# EAGLE design Wio Node v1.0 (EAGLE 6.4)

## Sheet 1 of 2
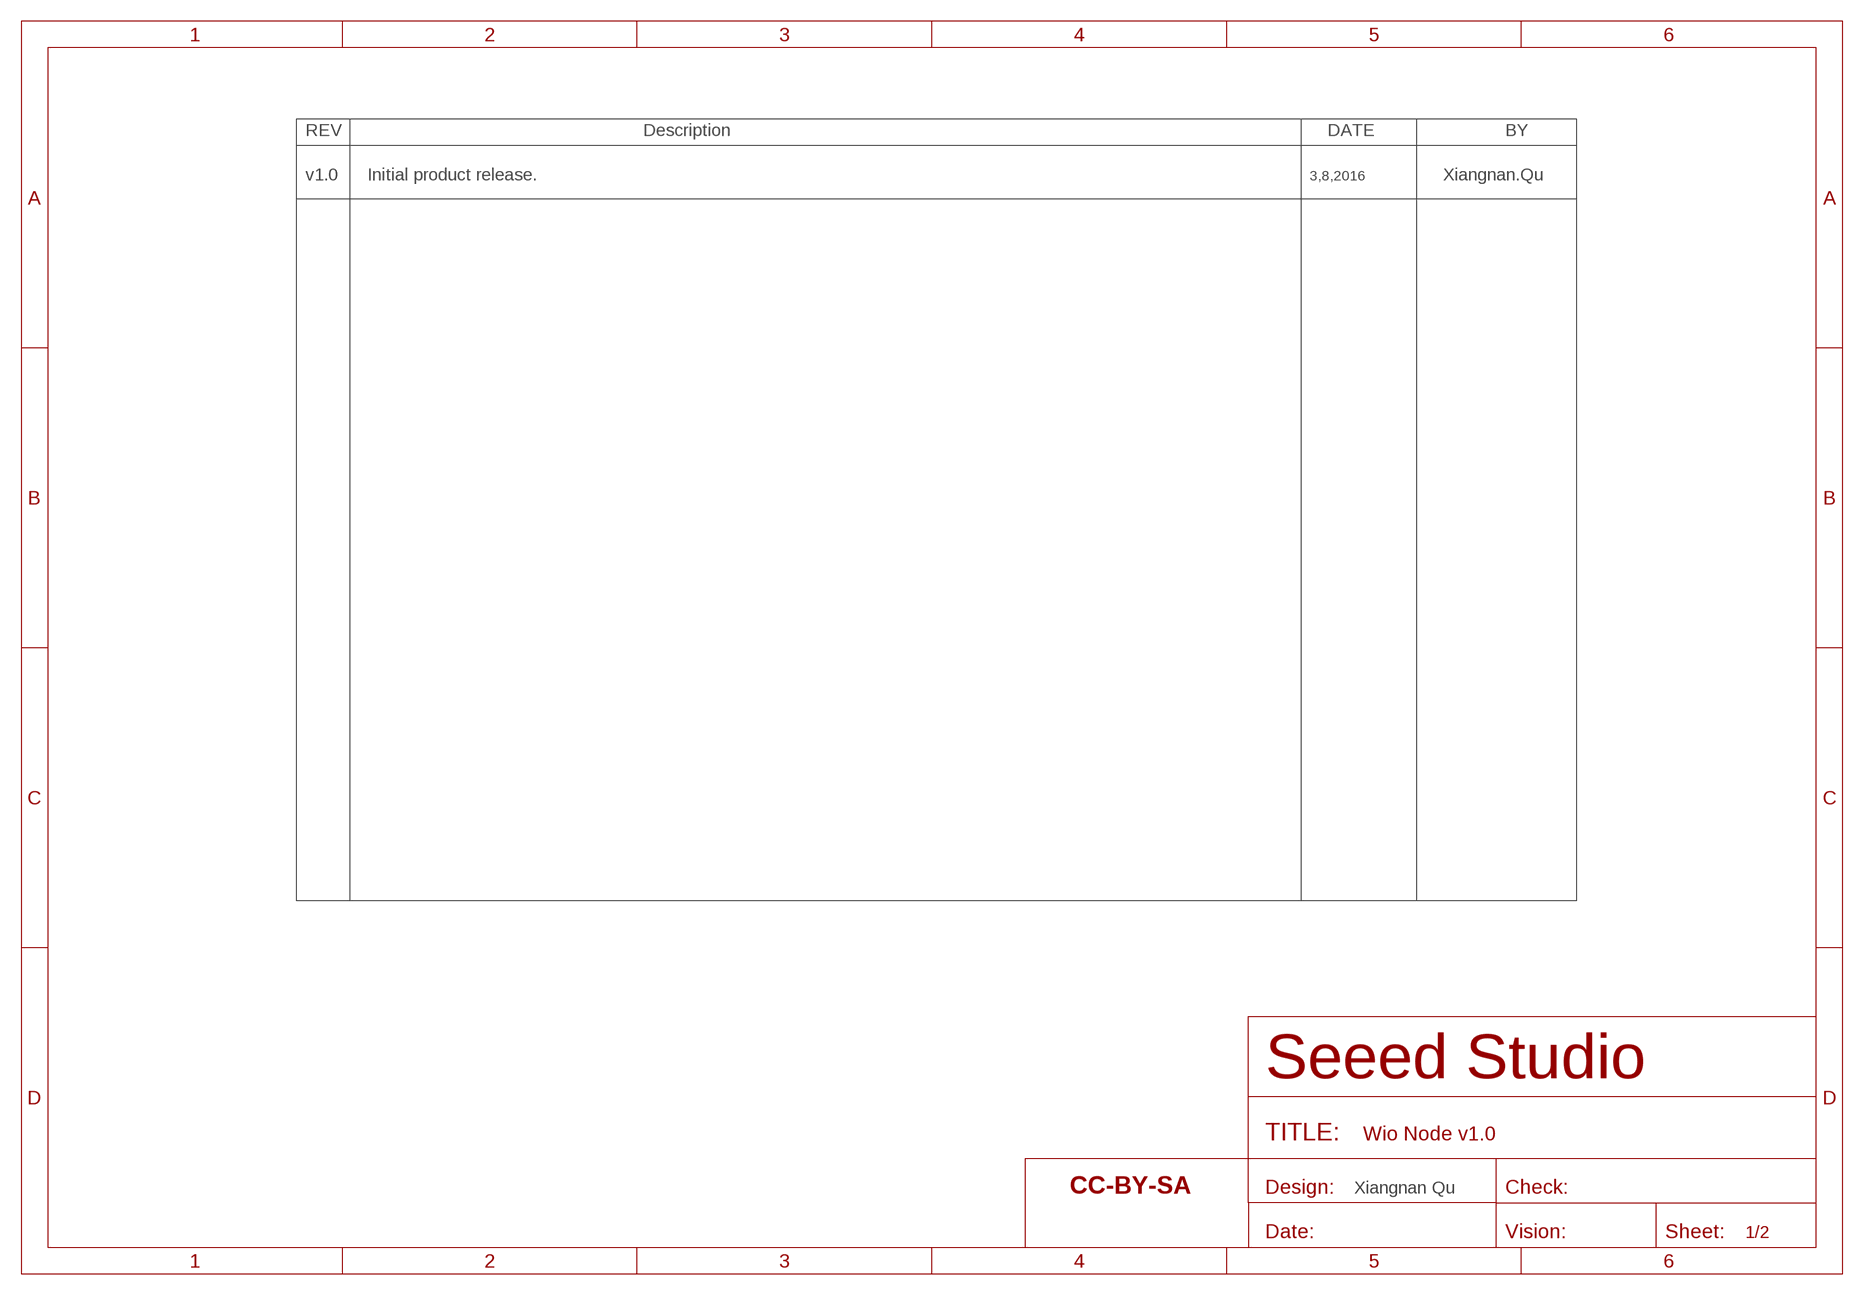
[diagram p0: schematic, sheet 1]

### Parts
FR4  SEEEDSTUDIO-OPEN-SCH-FRAME  [SEEEDSTUDIO-PCB-FRAME]

### Notes on the sheet
- v1.0 | Initial product release. | 3,8,2016 | Xiangnan.Qu
- Xiangnan Qu

## Sheet 2 of 2
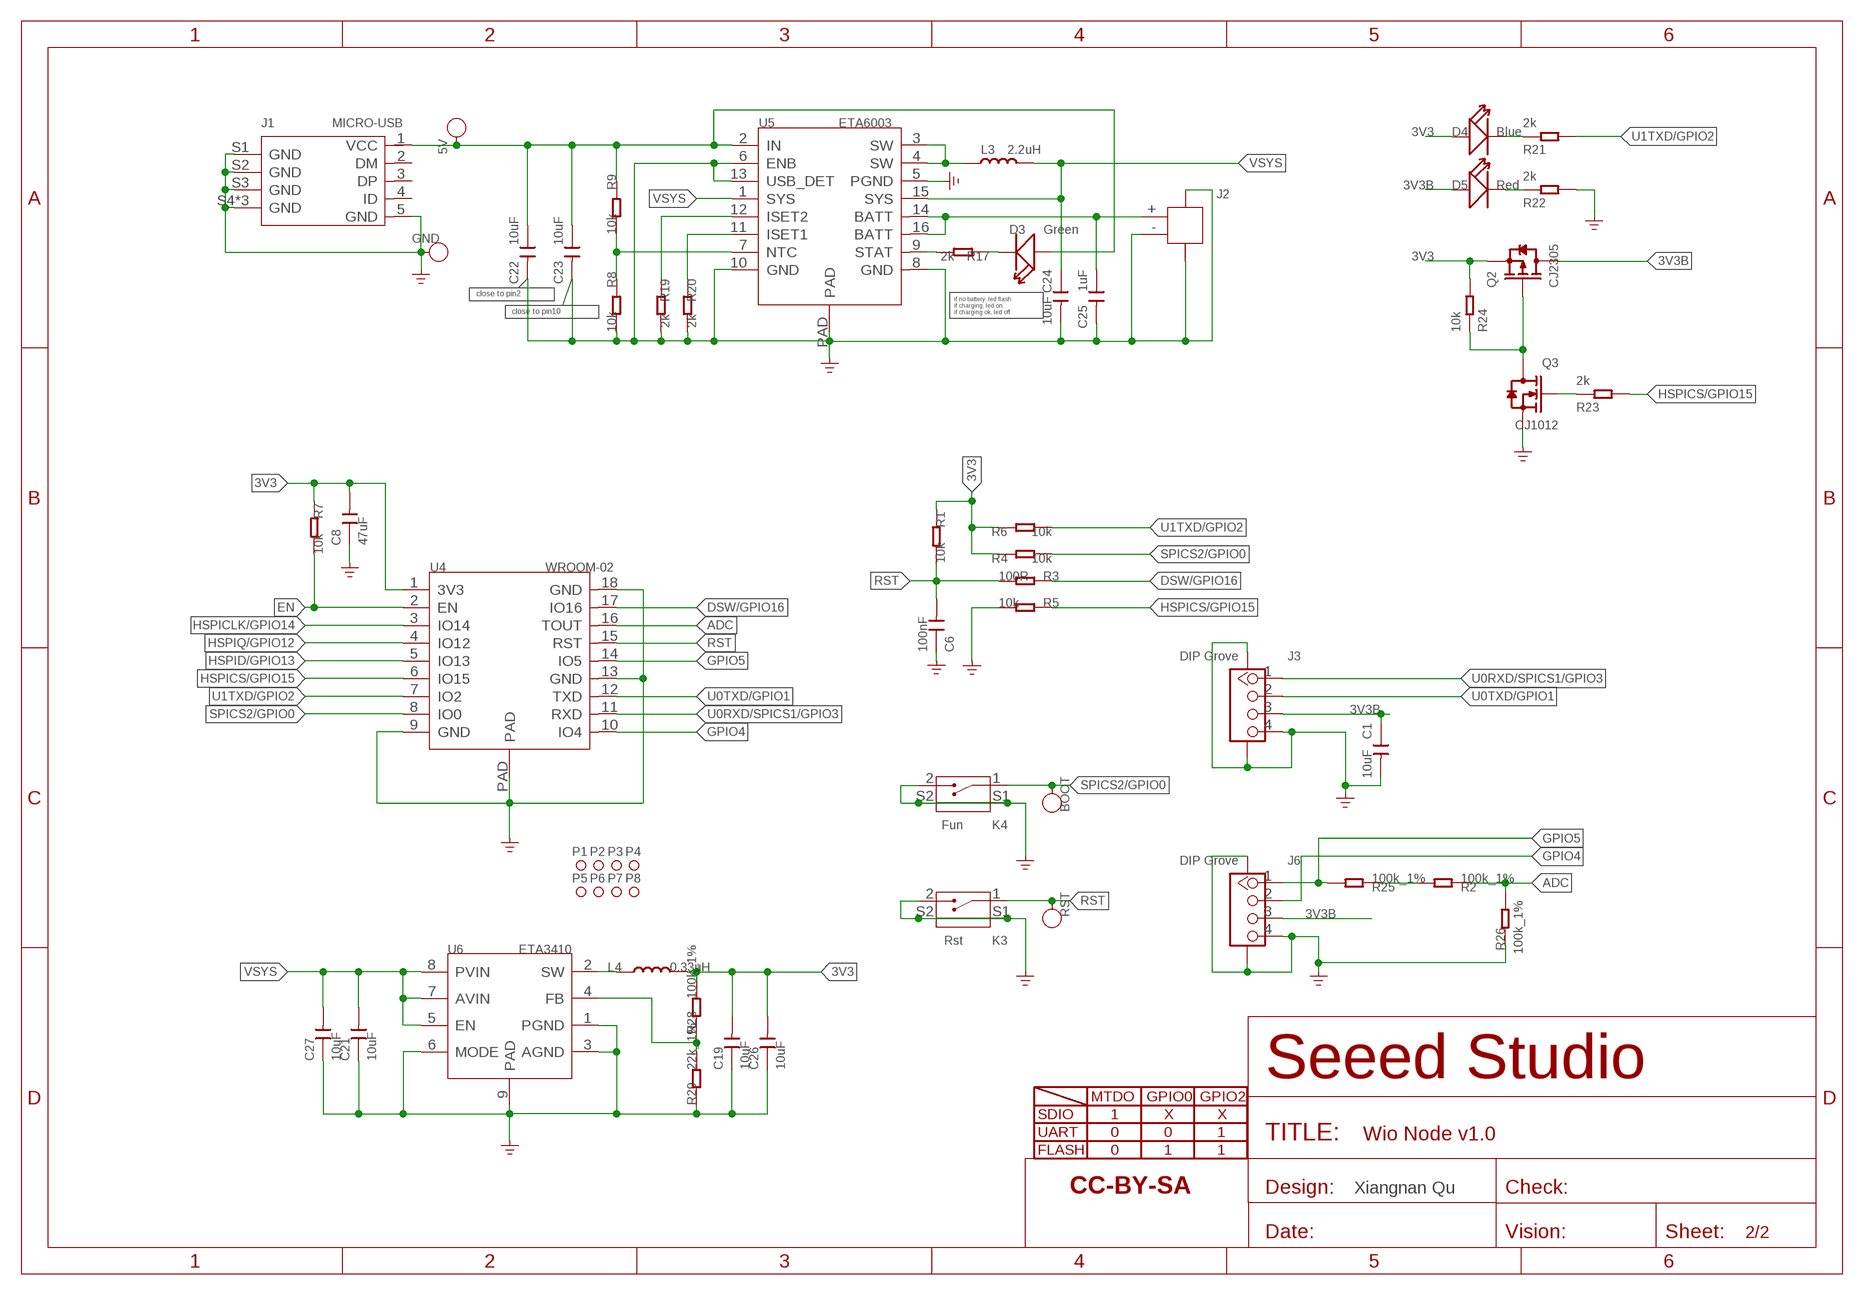
[diagram p1: schematic, sheet 2]

### Parts
5V  TEST-POINT'4545'  [TP-D45MIL]
BOOT  TEST-POINT'4545'  [TP-D45MIL]
C1  10uF  CAP-0402  [C0402]
C6  100nF  CAP-0201  [C0201]
C8  47uF  CAP-0805  [C0805]
C19  10uF  CAP-0402  [C0402]
C21  10uF  CAP-0402  [C0402]
C22  10uF  CAP-0805  [C0805]
C23  10uF  CAP-0402  [C0402]
C24  10uF  CAP-0402  [C0402]
C25  1uF  CAP-0402  [C0402]
C26  10uF  CAP-0402  [C0402]
C27  10uF  CAP-0402  [C0402]
D3  Green  LED-0402  [LED-0402]
D4  Blue  LED-0402  [LED-0402]
D5  Red  LED-0402  [LED-0402]
FR1  SEEEDSTUDIO-OPEN-SCH-FRAME  [SEEEDSTUDIO-PCB-FRAME]
GND  TEST-POINT'4545'  [TP-D45MIL]
J1  MICRO-USB  MICRO-USB5+4P'5+4P'  [MICRO-USB5+4P-SMD-0.65-B]
J2  JST-2P-SMD'2.0'  [HW2-SMD-2.0-90D]
J3  DIP Grove  GROVE-CONNECTOR-SMD'90D'  [HW4-SMD-2.0-90D]
J6  DIP Grove  GROVE-CONNECTOR-SMD'90D'  [HW4-SMD-2.0-90D]
K3  Rst  BUTTON-2+2P'HQ-TP-1100A'  [SW4-SMD-4.5X3.8X1.8MM-90D]
K4  Fun  BUTTON-2+2P'HQ-TP-1100A'  [SW4-SMD-4.5X3.8X1.8MM-90D]
L3  2.2uH  INDUCTOR/FERRITE-BEAD'0805'  [L0805]
L4  0.33uH  L-MPM201610SR33_T  [L201610]
P1  MARK-1.0'ANNULAR'  [ROUND-MARK-1.0]
P2  MARK-1.0'ANNULAR'  [ROUND-MARK-1.0]
P3  MARK-1.0'ANNULAR'  [ROUND-MARK-1.0]
P4  MARK-1.0'ANNULAR'  [ROUND-MARK-1.0]
P5  MARK-1.0'ANNULAR'  [ROUND-MARK-1.0]
P6  MARK-1.0'ANNULAR'  [ROUND-MARK-1.0]
P7  MARK-1.0'ANNULAR'  [ROUND-MARK-1.0]
P8  MARK-1.0'ANNULAR'  [ROUND-MARK-1.0]
Q2  CJ2305  MOSFET-P'SI2323CDS/SI2305DS<BR>'  [SOT-23]
Q3  CJ1012  MOSFET-N+  [SOT-523]
R1  10k  RES-0201  [R0201]
R2  100k_1%  RES-0201  [R0201]
R3  100R  RES-0201  [R0201]
R4  10k  RES-0201  [R0201]
R5  10k  RES-0201  [R0201]
R6  10k  RES-0201  [R0201]
R7  10k  RES-0201  [R0201]
R8  10k  RES-0201  [R0201]
R9  10k  RES-0201  [R0201]
R17  2k  RES-0201  [R0201]
R19  2k  RES-0201  [R0201]
R20  2k  RES-0201  [R0201]
R21  2k  RES-0201  [R0201]
R22  2k  RES-0201  [R0201]
R23  2k  RES-0201  [R0201]
R24  10k  RES-0201  [R0201]
R25  100k_1%  RES-0201  [R0201]
R26  100k_1%  RES-0201  [R0201]
R28  100k_1%  RES-0201  [R0201]
R29  22k_1%  RES-0402  [R0402]
RST  TEST-POINT'4545'  [TP-D45MIL]
U4  WROOM-02  MOUDLE-WIFI-ESP-WROOM-02  [ESP18-SMD-1.5-18X20MM]
U5  ETA6003  PMIC-ETA6003  [QFN16G-0.5-3X3MM]
U6  ETA3410  CONVERTER-ETA3410  [DFN8G-0.5-2X2MM]

### Nets
3V3: C8.2 C19.2 C26.2 D4.+ L4.2 Q2.2(S) R1.1 R4.1 R6.1 R7.1 R24.2 R28.2 U4.1(3V3)
3V3B: C1.1 D5.+ J3.3 J6.3 Q2.3(D)
ADC: R2.1 R26.2 U4.16(TOUT)
DSW/GPIO16: R3.1 U4.17(IO16)
EN: R7.2 U4.2(EN)
GND: C1.2 C6.1 C8.1 C19.1 C21.1 C22.2 C23.2 C24.2 C25.2 C26.1 C27.1 GND.T J1.5(GND) J1.S1(GND) J1.S2(GND) J1.S3(GND) J1.S4(GND) J1.S5(GND) J1.S6(GND) J2.3 J2.4 J2.- J3.4 J3.SS1 J3.SS2 J6.4 J6.SS1 J6.SS2 K3.2 K3.S1 K3.S2 K4.2 K4.S1 K4.S2 Q3.2(S) R5.2 R8.2 R19.2 R20.2 R22.2 R26.1 R29.1 U4.9(GND) U4.13(GND) U4.18(GND) U4.PAD U5.5(PGND) U5.6(ENB) U5.8(GND) U5.10(GND) U5.13(USB_DET) U5.PAD U6.1(PGND) U6.3(AGND) U6.6(MODE) U6.9(PAD) ; supply symbol labelled GND_POWER
GPIO4: J6.2 U4.10(IO4)
GPIO5: J6.1 R25.2 U4.14(IO5)
HSPICLK/GPIO14: U4.3(IO14)
HSPICS/GPIO15: R5.1 R23.2 U4.6(IO15)
HSPID/GPIO13: U4.5(IO13)
HSPIQ/GPIO12: U4.4(IO12)
N$1: R2.2 R25.1
N$3: R8.1 R9.2 U5.7(NTC)
N$7: Q2.1(G) Q3.3(D) R24.1
N$11: Q3.1(G) R23.1
N$14: D4.- R21.1
N$22: D5.- R22.1
N$26: L3.1 U5.3(SW) U5.4(SW)
N$28: C25.1 J2.+ U5.14(BATT) U5.16(BATT)
N$29: L4.1 U6.2(SW)
N$30: D3.- R17.1
N$31: R17.2 U5.9(STAT)
N$32: R28.1 R29.2 U6.4(FB)
N$34: R20.1 U5.11(ISET1)
N$36: R19.1 U5.12(ISET2)
RST: C6.2 K3.1 R1.2 R3.2 RST.T U4.15(RST)
SPICS2/GPIO0: BOOT.T K4.1 R4.2 U4.8(IO0)
U0RXD/SPICS1/GPIO3: J3.1 U4.11(RXD)
U0TXD/GPIO1: J3.2 U4.12(TXD)
U1TXD/GPIO2: R6.2 R21.2 U4.7(IO2)
VSYS: C21.2 C24.1 C27.2 L3.2 U5.1(SYS) U5.15(SYS) U6.5(EN) U6.7(AVIN) U6.8(PVIN)
VUSB: 5V.T C22.1 C23.1 D3.+ J1.1(VCC) R9.1 U5.2(IN)
Unconnected: J1.2(DM) J1.3(DP) J1.4(ID)

### Notes on the sheet
- close to pin2
- close to pin10
- if no battery, led flash.
  if charging, led on.
  if charging ok, led off.
- MTDO | GPIO0 | GPIO2
- SDIO | 1 | X | X
- UART | 0 | 0 | 1
- FLASH | 0 | 1 | 1
- Xiangnan Qu

## Library data of the parts
5V BOOT GND RST = Discrete-new:TEST-POINT; PARTNO: DNP
C1 C6 C8 C19 C21-C27 = Discrete-new:CAP: Ceramic Capacitors
D3-D5 = Discrete-new:LED
FR1 FR4 = moudle-new:SEEEDSTUDIO-OPEN-SCH-FRAME
J1 = Connector-new:MICRO-USB5+4P: 5+4P-SMD-0.65-B:320010000;5+2P-SMD-0.65-AB:340032001
J2 = Connector-new:JST-2P-SMD: 2P-SMD-1.0-90D:320110054;2P-SMD-2.0-90D:320110026
J3 J6 = Connector-new:GROVE-CONNECTOR-SMD: 4P-SMD-2.0:320110030;4P-SMD-2.0-90D:320110032
K3 K4 = Discrete-new:BUTTON-2+2P: SW4-SMD-4.5X3.8X1.8MM-90D:311020035;SW4-SMD-7.0X3.5X3.5MM-90D:311020023
L3 = Discrete-new:INDUCTOR/FERRITE-BEAD
L4 = Discrete-new:L
P1-P8 = Discrete-new:MARK-1.0; PARTNO: DNP
Q2 = Discrete-new:MOSFET-P
Q3 = Discrete-new:MOSFET-N+: IRLL014: http://www.vishay.com/docs/91319/sihll014.pdf
R1-R9 R17 R19-R26 R28 R29 = Discrete-new:RES
U4 = moudle-new:MOUDLE-WIFI-ESP-WROOM-02
U5 = template:PMIC-ETA6003: 2.5A,3MHZ Switching Charger with Dynamic Power Path Management
U6 = template:CONVERTER-ETA3410: 3MHZ 2A High Step-Down Converter in DFN2x2-8L Package

## Board
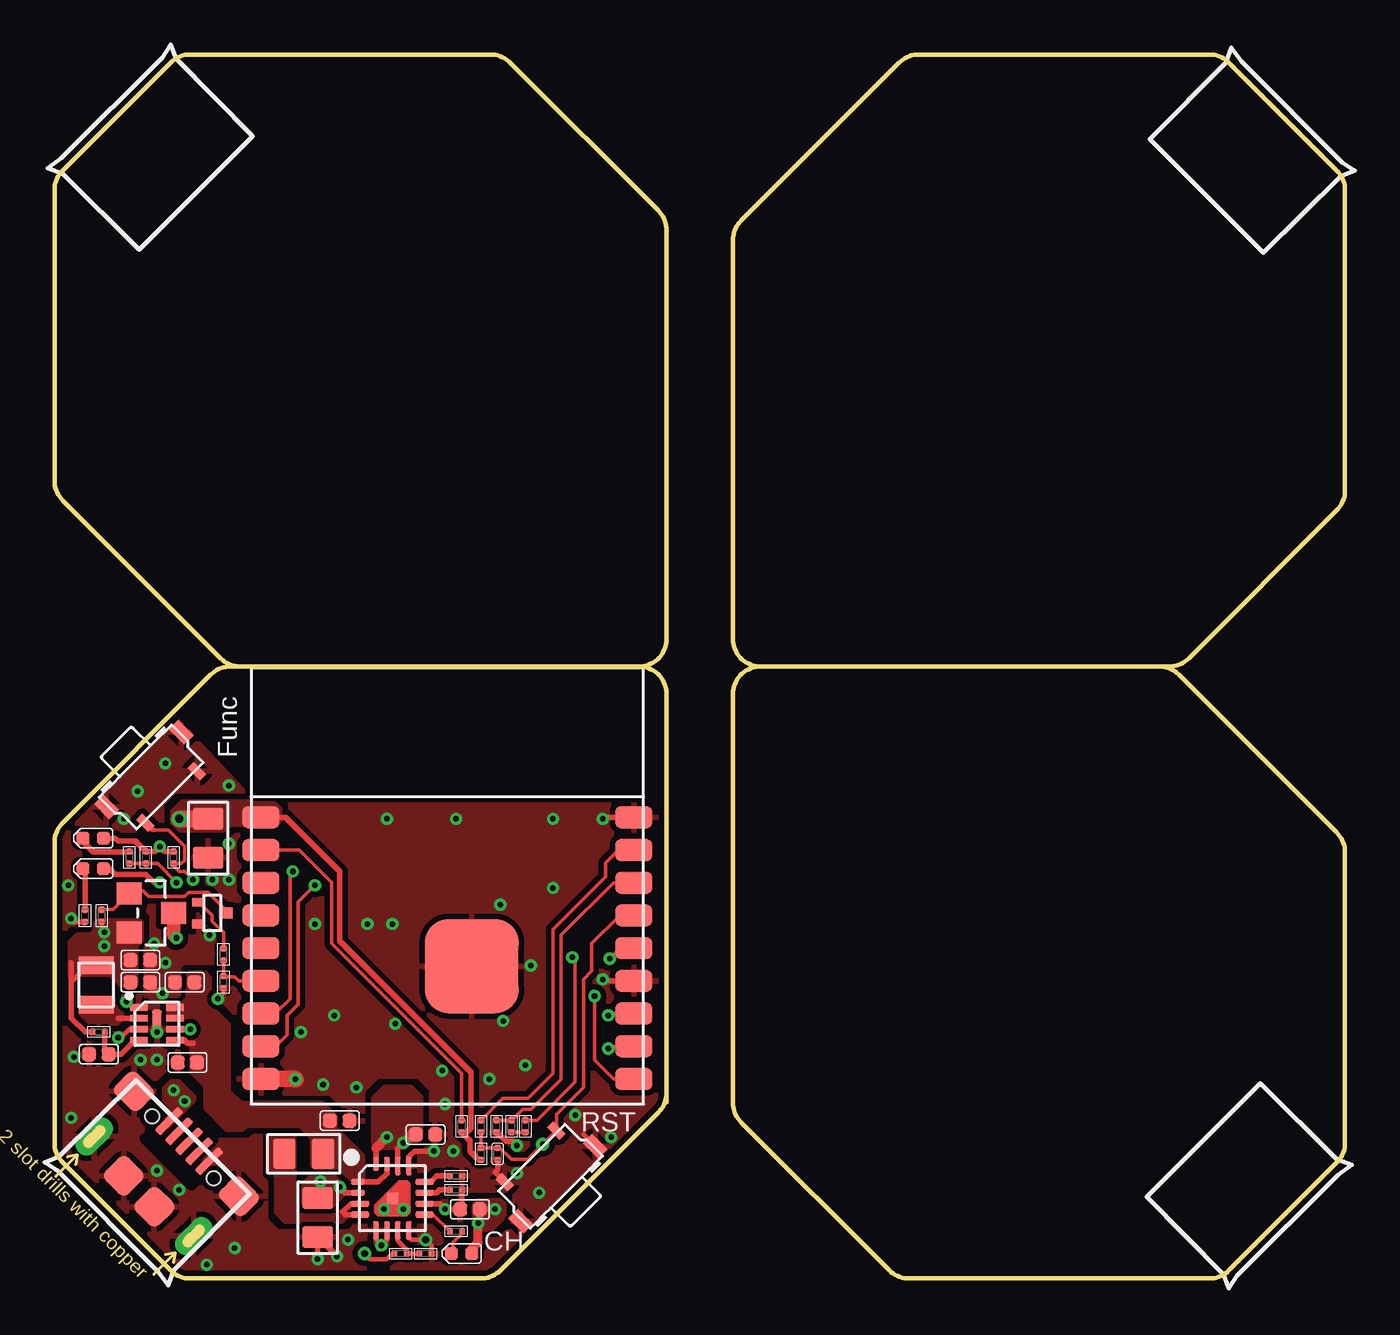
[diagram p2: board, top side]
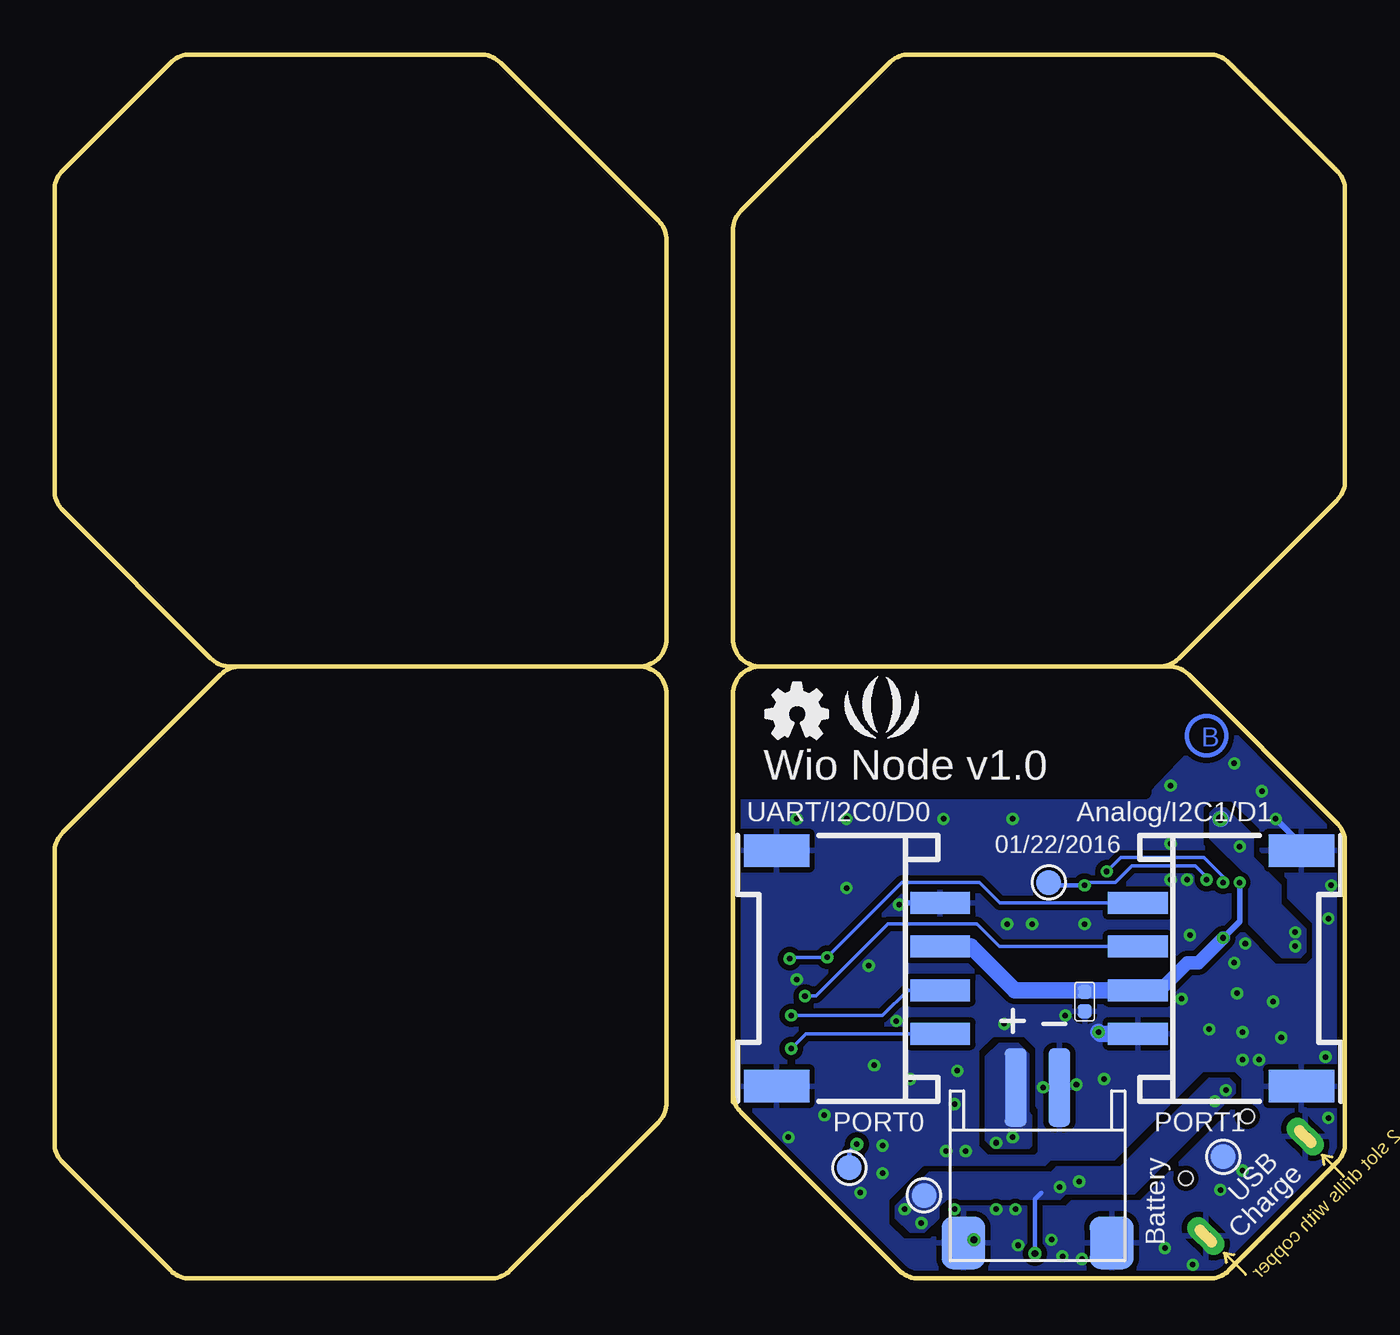
[diagram p3: board, bottom side, seen from below]

Size 59.18 x 56.13 mm. Coordinates in mm from the lower left corner, seen from the top.
Outline: 28.07,8.52 arc-45 27.7,7.62 20.45,0.37 arc-45 19.55,0 6.22,0 arc-45 5.32,0.37 0.37,5.32 arc-45 0,6.22 0,20 arc-45 0.37,20.89 7.17,27.7 arc-45 8.07,28.07 8.52,28.07
Outline: 28.07,8.52 28.07,26.8 arc90 26.8,28.07
Outline: 28.07,8.52 28.07,8.07
Outline: 8.52,28.07 arc-45 7.62,28.44 0.37,35.69 arc-45 0,36.59 0,49.92 arc-45 0.37,50.81 5.32,55.76 arc-45 6.22,56.13 20,56.13 arc-45 20.89,55.76 27.7,48.96 arc-45 28.07,48.06 28.07,29.34 arc-90 26.8,28.07
Outline: 8.52,28.07 26.8,28.07
Outline: 50.66,28.07 arc-45 51.56,27.7 58.81,20.45 arc-45 59.18,19.55 59.18,6.22 arc-45 58.81,5.32 53.86,0.37 arc-45 52.96,0 39.19,0 arc-45 38.29,0.37 31.49,7.17 arc-45 31.11,8.07 31.11,26.8 arc-90 32.38,28.07
Outline: 50.66,28.07 32.38,28.07
Outline: 32.38,28.07 arc-90 31.11,29.34 31.11,47.62 arc-45 31.49,48.51 38.74,55.76 arc-45 39.63,56.13 52.96,56.13 arc-45 53.86,55.76 58.81,50.81 arc-45 59.18,49.92 59.18,36.14 arc-45 58.81,35.24 52.01,28.44 arc-45 51.11,28.07 50.66,28.07
Copper layers (1*16): Top 0.035mm / dielectric 1.5mm / Bottom 0.035mm
Design rules "SeeedStudio_2layer_DRU_no_angle_20140221 *": minimum track width 1mil, minimum drill 10mil, track to track 6mil, track to pad 6mil, pad to pad 6mil, via to via 6mil, smd to smd 0mil, copper to edge 10mil, drill to drill 10mil, minimum pad ring 10mil, minimum via ring 6mil, stop-mask expansion 2mil, vias tented up to drill 25mil, thermal gap 10mil
Holes 2 mm at 1.91,60.33 57.15,60.33 1.91,-4.45 57.15,-4.45
tRestrict: area 18.4,23.5 to 18.8,25; area 119.4,-25.7 to 138.6,-19.6; area 9.1,22.1 to 27.7,27.9; area 14.6,2.9 to 16.4,4.4
bRestrict: area 119.4,-25.7 to 138.6,-19.6; area 9.1,22.2 to 27.7,28.1

### Footprints (pad centres in the part's own frame; a part is rotated, then mirrored left to right if it is on the bottom)
TP-D45MIL = smd 1.143 x 1.143: T 0,0
C0402 = smd 0.635 x 0.635: 1 0,0.445; 2 0,-0.445
C0201 = smd 0.279 x 0.318: 1 -0.279,0; 2 0.279,0
C0805 = smd 1.397 x 1.016: 1 0,0.889; 2 0,-0.889
LED-0402 = smd 0.58 x 0.58: + -0.468,0; - 0.468,0
MICRO-USB5+4P-SMD-0.65-B = smd 0.381 x 1.524: 1 -1.3,-0.25; 2 -0.65,-0.25; 3 0,-0.25; 4 0.65,-0.25; 5 1.3,-0.25 | smd 1.6 x 1.397: S1 -3.4,-0.427; S6 3.4,-0.427 | drill 0.508 pad 1.016 long: S2 -3.226,-3.175; S5 3.226,-3.175 | smd 1.5 x 1.5: S3 -1,-3.5; S4 1,-3.5 | hole 0.635: -2,-0.65; 2,-0.65
HW2-SMD-2.0-90D = smd 2 x 2.4: 3 3.4,-2.181; 4 -3.4,-2.181 | smd 1 x 3.6: + -1,4.953; - 1,4.953
HW4-SMD-2.0-90D = smd 1.01 x 2.74: 1 -3,-0.1; 2 -1,-0.1; 3 1,-0.1; 4 3,-0.1 | smd 1.5 x 3: SS1 -5.4,7.4; SS2 5.4,7.4
SW4-SMD-4.5X3.8X1.8MM-90D = smd 0.4 x 0.8: 1 -1.675,-1.277; 2 1.675,-1.277 | smd 0.6 x 1: S1 -2.425,0.5; S2 2.425,0.5
L0805 = smd 1.016 x 1.397: 1 -0.889,0; 2 0.889,0
L201610 = smd 0.8 x 1.6: 1 -0.9,0; 2 0.9,0
ROUND-MARK-1.0 = smd 1.016 x 1.016: P$1 0,0
SOT-23 = smd 1.016 x 1.143: 1 -0.889,-1.016; 2 0.889,-1.016; 3 0,1.016
SOT-523 = smd 0.4 x 0.6: 1 0.5,0.62; 2 -0.5,0.62 | smd 0.5 x 0.6: 3 0,-0.62
R0201 = smd 0.279 x 0.318: 1 -0.279,0; 2 0.279,0
R0402 = smd 0.635 x 0.635: 1 0,0.445; 2 0,-0.445
ESP18-SMD-1.5-18X20MM = smd 1.7 x 1: 1 0.45,13.15; 2 0.45,11.65; 3 0.45,10.15; 4 0.45,8.65; 5 0.45,7.15; 6 0.45,5.65; 7 0.45,4.15; 8 0.45,2.65; 9 0.45,1.15; 10 17.55,1.15; 11 17.55,2.65; 12 17.55,4.15; 13 17.55,5.65; 14 17.55,7.15; 15 17.55,8.65; 16 17.55,10.15; 17 17.55,11.65; 18 17.55,13.15 | smd 4.3 x 4.3: PAD 10.12,6.32
QFN16G-0.5-3X3MM = smd 0.65 x 0.28: 1 -1.575,0.75; 2 -1.575,0.25 | smd 0.85 x 0.28: 3 -1.475,-0.25; 4 -1.475,-0.75; 9 1.475,-0.75; 10 1.475,-0.25; 11 1.475,0.25; 12 1.475,0.75 | smd 0.28 x 0.85: 5 -0.75,-1.475; 6 -0.25,-1.475; 7 0.25,-1.475; 8 0.75,-1.475; 13 0.75,1.475; 14 0.25,1.475 | smd 0.28 x 0.65: 15 -0.25,1.575; 16 -0.75,1.575 | smd 0.508 x 0.508: PAD 0,0
DFN8G-0.5-2X2MM = smd 0.8 x 0.3: 1 -0.827,0.75; 2 -0.827,0.25; 3 -0.827,-0.25; 4 -0.827,-0.75; 5 0.827,-0.75; 6 0.827,-0.25; 7 0.827,0.25; 8 0.827,0.75 | smd 0.45 x 1.3: 9 0,0

### Placement (x,y rotation side)
5V  19.3,3.81 0 bottom
BOOT  13.59,18.16 0 bottom
C1  11.94,12.7 0 bottom
C6  20.32,5.71 90 top
C8  7.05,20.19 180 top
C19  3.94,14.61 270 top
C21  5.97,13.59 90 top
C22  12.06,2.79 0 top
C23  19.05,3.17 270 top
C24  13.08,7.24 90 top
C25  17.02,6.6 90 top
C26  3.94,13.59 270 top
C27  6.1,9.91 90 top
D3  18.67,1.14 180 top
D4  1.78,20.19 180 top
D5  1.78,18.8 180 top
FR1  -8.13,-24.89 0 top  (outside the outline)
FR4  -9.27,-34.54 0 top  (outside the outline)
GND  5.59,5.59 0 bottom
J1  6.35,6.48 315 top
J2  14.1,3.81 0 bottom
J3  18.67,14.22 90 bottom
J6  9.4,14.22 270 bottom
K3  22.73,4.7 225 top
K4  4.45,22.99 45 top
L3  11.43,5.71 0 top
L4  1.91,13.46 90 top
P1  11.43,-4.45 90 top  (outside the outline)
P2  11.43,-4.45 270 bottom  (outside the outline)
P3  6.99,60.33 90 top  (outside the outline)
P4  6.99,60.33 270 bottom  (outside the outline)
P5  52.07,60.33 90 top  (outside the outline)
P6  52.07,60.33 270 bottom  (outside the outline)
P7  52.07,-4.45 90 top  (outside the outline)
P8  52.07,-4.45 270 bottom  (outside the outline)
Q2  4.45,16.76 270 top
Q3  7.24,16.76 90 top
R1  19.56,5.71 90 top
R2  20.95,6.99 270 top
R3  19.56,6.99 270 top
R4  5.46,19.3 270 top
R5  7.75,13.59 270 top
R6  4.19,19.3 270 top
R7  18.67,6.99 90 top
R8  17.02,1.14 0 top
R9  15.88,1.14 0 top
R17  18.41,2.16 180 top
R19  18.41,4.7 0 top
R20  18.41,4.06 0 top
R21  3.43,19.3 270 top
R22  1.4,16.64 270 top
R23  7.75,14.86 270 top
R24  2.16,16.64 270 top
R25  21.59,6.99 90 top
R26  20.27,6.99 90 top
R28  2.03,11.3 180 top
R29  2.03,10.29 90 top
RST  22.73,5.08 0 bottom
U4  9.02,8 0 top
U5  15.49,3.68 0 top
U6  4.7,11.68 0 top
U$2  [OSHW_FILLX100_NOTEXT]  26.54,24.77 0 bottom
U$3  [SEEED-SILK-160*153MIL]  21.21,26.29 0 bottom

### Tracks (layer width: path | path; a pad name or v marks a point on that pad's centre or on a via)
3V3  (via drill 0.25, 0.38)
  Top 0.203: 0.76,13.59 1.27,14.1
  Top 0.254: R1.1 19.46,5.44 19.05,5.84 19.05,6.33 R7.1 18.9,6.71 19.11,6.92 19.11,9.46 13.08,15.49 13.08,18.67 10.6,21.15 U4.1 | R28.2 1.4,11.3 0.76,11.94 0.76,13.59 0.76,14.48 | D4.+ 2.79,20.19 2.92,20.07 3.71,20.07 R6.1 4.6,19.58 v4.83,19.81 5.05,19.58 R4.1
  Top 0.762: C8.2 v5.71,21.08
  Bottom 0.762: v5.71,21.08 5.69,21.08
  other vias: 2.29,15.88 2.29,15.24
  pour Top (isolate 0.203, no thermals): 2.03,16.51 3.94,16.51 4.06,16.38 4.06,15.49 3.81,15.24 3.81,13.46 3.68,13.34 3.05,13.34 2.54,13.84 0.64,13.84 0.64,15.49 1.02,15.88 1.65,15.88 1.78,16 1.78,16.26
  pour Bottom (isolate 0.203): 5.46,21.59 5.97,21.59 6.22,21.34 6.22,20.19 4.45,18.41 4.45,16.26 2.92,14.73 2.03,14.73 1.78,14.99 1.78,16 2.92,17.14 2.92,18.03 4.19,19.3 4.19,20.32
  pour Top (isolate 0.203, no thermals): 5.84,21.97 10.03,21.97 10.41,21.59 10.41,20.95 10.16,20.7 8,20.7 7.75,20.45 5.71,20.45 5.33,20.83 5.33,21.46
3V3B  (via drill 0.25)
  Top 0.254: D5.+ 2.54,18.8 2.79,18.54 4.19,18.54 4.57,18.16 v4.83,18.16
  Top 0.61: Q2.3 5.46,15.75 v5.59,15.62
  Bottom 0.203: C1.1 11.94,13.22
  Bottom 0.254: J6.3 8.49,13.22 | v4.83,18.16 4.83,16.38 v5.59,15.62
  Bottom 0.61: 8.49,13.22 7.24,14.48 6.73,14.48 v5.59,15.62
  Bottom 0.762: J6.3 11.94,13.22 15.13,13.22 17.14,15.24 18.55,15.24 J3.3
ADC
  Top 0.152: R26.2 R2.1 20.98,7.26 21.46,7.75 21.84,7.75 23.24,9.14 23.24,15.75 25.64,18.15 U4.16
DSW/GPIO16
  Top 0.152: U4.17 25.87,19.65 25.27,19.05 25.27,18.41 22.86,16 22.86,9.4 21.72,8.26 20.55,8.26 R3.1
EN
  Top 0.152: U4.2 11.21,19.65 12.7,18.16 12.7,15.37 18.67,9.4 R7.2
GND  (via drill 0.25, 0.3)
  Top 0.025: U5.PAD 15.49,3.56 v15.11,3.17
  Top 0.152: R5.2 7.75,13.08 v7.49,12.83 | Q3.2 6.62,16.24 v7.11,15.75
  Top 0.203: U6.3 3.43,11.43 3.05,11.05 v2.92,11.05 | 24.26,6.6 24.77,6.1 | K3.S1 24.26,6.6 | 24.26,6.6 | U5.8 16.24,1.92 16.38,1.78 v17.02,1.78 17.3,1.5 R8.2 | U5.6 15.24,1.78 v14.99,1.52 14.74,1.77 U5.5 | R20.2 18.69,3.26 C23.2
  Top 0.254: R26.1 20.28,6.71 20.7,6.29 21.02,6.29 v21.21,6.1 | K3.2 20.19,4.87 20.34,5.02 20.34,5.44 C6.1 | U5.10 17.65,3.43 v17.91,3.17 C23.2 | U5.13 16.24,5.58 16.51,5.84 v17.4,5.84 | v12.06,0.89 C22.2 v12.95,1.02 | U6.6 v6.22,11.43 | R22.2 0.91,16.36 v0.76,16.51 | U4.13 25.21,13.65 v25.15,13.72 | U4.18 25.21,21.15 v25.15,21.08 | U6.1 3.57,12.43 v3.3,12.7 | C26.1 4.38,13.4 4.57,13.21 4.95,13.21 5.08,13.08
  Top 0.762: U4.9 v11.04,9.15 v11.05,9.14
  Bottom 0.203: J2.4 17.17,1.63 v17.02,1.78
  Bottom 0.254: J3.4 20.37,17.22 v20.45,17.14 | J6.SS1 2,19.91 v3.17,21.08
  Bottom 0.762: J6.4 11.22,11.22 v11.3,11.3
  other vias: 21.21,4.83 18.29,5.84 12.32,8.89 13.84,8.76 16,3.17 0.89,10.16 3.94,10.03 4.7,10.03 4.7,11.3 0.64,18.03 4.95,13.08 5.08,14.48 8,18.29 7.24,18.29 8,19.94 14.35,16.26 15.49,16.26 12.83,12.06 15.62,11.68 17.78,9.53 17.91,8 19.94,9.14 21.59,9.78 20.57,11.81 21.84,14.35 22.86,17.91 22.86,21.08 15.24,21.08 18.41,21.08 5.08,23.62 3.81,22.35 8,22.61 23.88,7.49 25.53,6.48 6.99,0.64 22.23,3.94 13.46,1.78 8.26,1.4 4.7,4.95 5.71,4.06 0.76,7.37 4.57,15.37 11.94,16.26
  pour Top (isolate 0.254, rank 3): 8.89,22.1 27.3,29.34 29.34,27.3 29.34,6.99 20.57,-1.78 4.95,-1.78 -2.67,5.84 -2.67,19.94 1.02,26.16 3.56,27.81
  pour Bottom (isolate 0.254, rank 3): 3.56,27.81 8.89,22.23 29.08,26.92 29.08,6.6 20.32,-2.16 4.7,-2.16 -2.92,5.46 -2.92,19.56 0.89,26.16
  pour Top (rank 3, no thermals): 5.71,14.1 5.71,12.95 4.19,12.95 4.19,15.37 4.83,15.37
  pour Top (no thermals): 6.86,5.46 7.75,6.35 8.51,6.35 8.51,5.08 6.86,5.08
GPIO4  (via drill 0.25)
  Top 0.152: U4.10 25.65,9.15 24.77,10.03 v24.77,12.95
  Bottom 0.152: J6.2 15.86,15.22 16.89,16.26 20.95,16.26 24.26,12.95 v24.77,12.95
GPIO5  (via drill 0.25)
  Top 0.152: U4.14 25.95,15.15 v25.46,14.67 | R25.2 22.12,7.26 23.88,9.02 23.88,14.61 v23.75,14.73
  Bottom 0.152: J6.1 15.83,17.22 16.76,18.16 20.32,18.16 v23.75,14.73 25.4,14.73 v25.46,14.67
HSPICS/GPIO15
  Top 0.152: U4.6 8.45,13.65 8.26,13.84 7.77,13.84 R5.1 R23.2
N$1
  Top 0.152: R25.1 R2.2
N$3
  Top 0.203: U5.7 15.74,1.72 16.15,1.31 R9.2 R8.1
N$7
  Top 0.152: R24.1 2.69,16.92 Q2.1 3.56,17.78 4.06,17.78 4.32,17.53 5.97,17.53 6.16,17.72 7.05,17.72 7.86,16.91 Q3.3
N$11
  Top 0.152: R23.1 7.75,15.88 7.24,16.38 7.24,16.64 Q3.1
N$14
  Top 0.254: D4.- 1.31,20.03 1.78,19.56 3.4,19.56 R21.1
N$22
  Top 0.254: R22.1 1.4,18.71 D5.-
N$26
  Top 0.254: U5.3 13.59,3.43 13.21,3.05 13.32,2.93 U5.4
  pour Top (isolate 0.203, no thermals): 10.03,6.6 10.92,6.6 11.05,6.48 11.05,3.17 11.24,2.98 12.95,2.98 13.14,3.17 13.34,3.17 13.4,3.11 13.4,2.73 13.21,2.54 10.54,2.54 10.1,2.98 10.1,4.7 9.84,4.95 9.84,6.41
N$28  (via drill 0.25)
  Top 0.254: U5.16 14.74,5.98 | U5.14 15.74,5.96 v16,6.22
  Top 0.406: C25.1 16.38,6.6 v16,6.22 | 14.74,5.98 v15.24,6.48
  pour Top (isolate 0.203, no thermals): 15.11,8.89 16.38,8.89 16.89,8.38 16.89,6.48 16.64,6.22 16.38,6.22 16.07,5.91 14.8,5.91 14.54,6.16 14.54,8.32
  pour Bottom (isolate 0.254, no thermals): 14.99,10.79 15.88,10.79 16.51,10.16 16.51,6.35 16.13,5.97 14.48,5.97 14.35,6.1 14.35,7.49 14.48,7.62 14.48,10.29
N$29
  Top 0.254: U6.2 3.18,11.93 3.17,11.94 2.92,11.94
  pour Top (isolate 0.203, no thermals): 1.27,12.95 2.67,12.95 2.79,12.83 2.79,12.57 3.17,12.19 3.17,11.87 2.92,11.62 1.59,11.62 1.14,12.06 1.14,12.83
N$30
  Top 0.152: R17.1 18.69,2.06 18.29,1.65 18.29,1.23 D3.-
N$31
  Top 0.152: U5.9 17.36,2.93 R17.2
N$32
  Top 0.254: U6.4 3.69,10.93 3.05,10.29 R29.2 2.31,10.45 R28.1
N$34
  Top 0.254: U5.11 17.52,3.93 17.65,4.06 R20.1
N$36
  Top 0.254: U5.12 17.26,4.43 17.53,4.7 R19.1
RST  (via drill 0.25 pad 0.61)
  Top 0.152: R3.2 R1.2 C6.2 20.42,5.99 20.95,5.46 21.69,5.46 v22.38,6.16 K3.1 23.01,7.52 24.26,8.76 24.26,13.72 24.64,14.1 24.64,15.37 25.91,16.64 26.55,16.64 U4.15
  Bottom 0.203: v22.38,6.16 22.73,5.81 RST.T
SPICS2/GPIO0  (via drill 0.25)
  Top 0.152: U4.8 10.14,10.65 10.67,11.18 10.67,12.06 11.18,12.57 11.18,17.27 v11.94,18.03 | 4.57,20.57 5.21,20.57 5.97,19.81 5.97,19.18 5.82,19.02 R4.2 5.46,18.92 5.71,18.67 5.97,18.67 v6.35,18.29
  Top 0.203: K4.1 4.49,20.57 4.57,20.57
  Bottom 0.152: v11.94,18.03 11.81,18.16 10.54,18.16 9.78,18.92 6.86,18.92 6.35,18.41 v6.35,18.29
  Bottom 0.203: v11.94,18.03 13.46,18.03 arc90 BOOT.T
U0RXD/SPICS1/GPIO3  (via drill 0.25)
  Top 0.152: U4.11 25.51,10.65 v25.4,10.54
  Bottom 0.152: J3.1 24.72,11.22 v25.4,10.54
U0TXD/GPIO1  (via drill 0.25)
  Top 0.152: U4.12 25.49,12.15 v25.4,12.06
  Bottom 0.152: J3.2 20.05,13.22 21.21,12.06 v25.4,12.06
U1TXD/GPIO2  (via drill 0.25)
  Top 0.152: R21.2 R6.2 4.72,19.02 v5.59,18.16 | U4.7 10.12,12.15 10.79,12.83 10.79,18.54 v10.92,18.67
  Bottom 0.152: v10.92,18.67 10.29,19.3 6.48,19.3 5.59,18.41 v5.59,18.16
VSYS
  Top 0.254: U5.1 14.85,4.43 15.24,4.83 U5.15 | U6.5 5.96,10.93 6.1,10.79 6.35,10.79
  pour Top (isolate 0.203, no thermals): 12.32,8.13 12.95,7.49 12.95,6.92 14.22,5.65 14.22,4.51 14.1,4.38 13.65,4.38 13.02,5.02 11.87,5.02 11.75,5.14 11.75,6.41 11.24,6.92 8.83,6.92 8.64,6.73 7.87,6.73 6.86,7.75 6.86,8.76 6.22,9.4 6.22,11.68 6.1,11.81 5.27,11.81 5.14,11.94 5.14,12.45 5.33,12.64 5.78,12.64 6.03,12.89 6.03,13.91 6.22,14.1 6.92,14.1 7.18,13.84 7.18,12.57 8.06,11.68 8.06,8.64 8.57,8.13
VUSB  (via drill 0.25, 0.3)
  Top 0.203: R9.1 15.6,1.12 15.47,1.12 15.24,0.89 14.48,0.89 v14.22,1.14
  Top 0.254: v20.19,3.17 C23.1 19.49,2.6 v19.43,2.54 | U5.2 13.34,3.93 v13.08,4.19
  Top 0.406: D3.+ 19.14,1.36 19.43,1.65 v19.43,2.54
  Bottom 0.203: v14.22,1.14 14.22,3.63 U5.2
  other vias: 12.19,4.45 5.46,8.64 5.97,8.13
  pour Top (isolate 0.203, no thermals): 11.68,4.7 12.89,4.7 13.4,4.19 13.4,3.87 12.76,3.24 11.56,3.24 11.37,3.43 11.37,4.38
  pour Top (no thermals): 19.43,3.68 20.45,3.68 20.7,3.43 20.7,2.79 20.07,2.16 19.43,2.16 19.18,2.41 19.18,3.43
  pour Top (isolate 0.203, no thermals): 5.33,9.14 5.71,9.14 6.48,8.38 6.48,8.13 5.21,6.86 5.08,6.86 4.95,6.99 4.95,7.24 5.21,7.49 5.21,7.87 4.95,8.13 4.95,8.76
  pour Bottom (isolate 0.203, no thermals): 5.33,9.14 6.22,9.14 10.29,5.08 13.21,5.08 13.46,4.83 19.05,4.83 20.57,3.3 20.57,2.79 19.94,2.16 19.3,2.16 18.67,2.79 18.67,3.3 18.29,3.68 13.08,3.68 12.83,3.94 9.65,3.94 5.08,8.51 5.08,8.89
(copper drawn outside any net)
  shapes: Bottom circle x1

### Text on the board
Bottom: B
tPlace: Func | RST | CH
bPlace: Wio Node v1.0 | Analog/I2C1/D1 | UART/I2C0/D0 | 01/22/2016 | PORT1 | PORT0 | USB | Charge | Battery